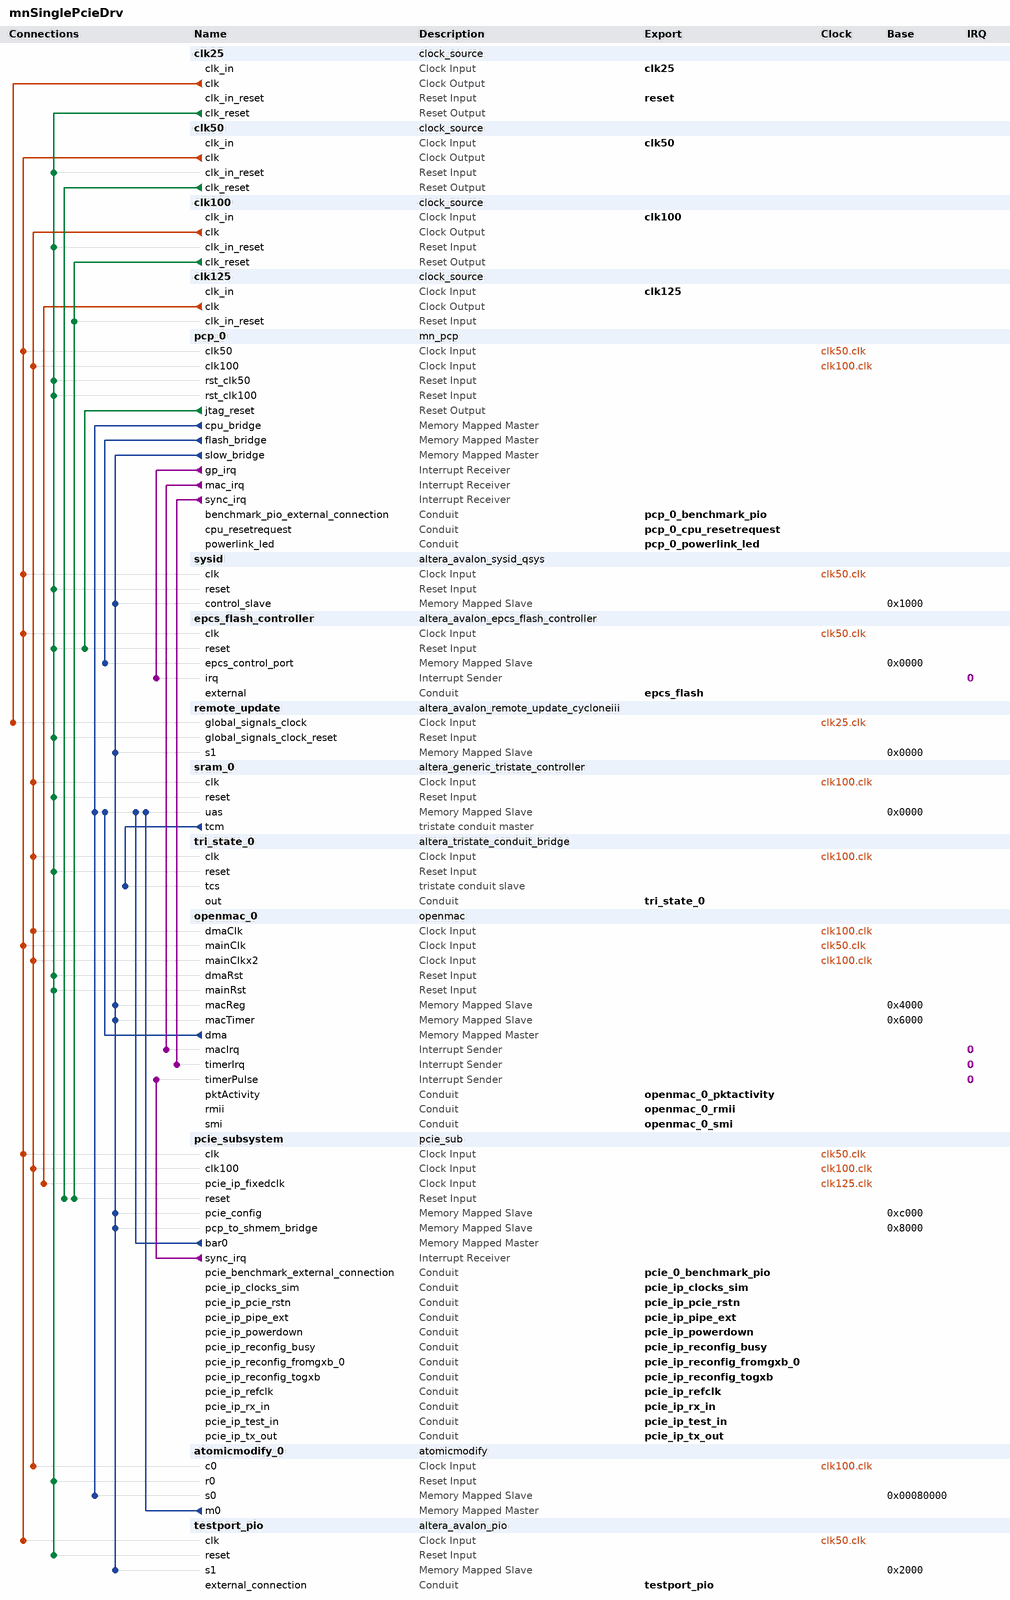
[diagram p0: system contents]
# Platform Designer (Qsys) system mnSinglePcieDrv, Cyclone IV GX EP4CGX30CF19I7
# Parameters at their usual value, and those the tool derives, are not listed.
package require -exact qsys 13.0
create_system mnSinglePcieDrv
set_project_property DEVICE_FAMILY {Cyclone IV GX}
set_project_property DEVICE EP4CGX30CF19I7

add_instance clk25 clock_source 13.0
set_instance_parameter_value clk25 clockFrequency 25000000

add_instance clk50 clock_source 13.0
set_instance_parameter_value clk50 clockFrequency 50000000

add_instance clk100 clock_source 13.0
set_instance_parameter_value clk100 clockFrequency 100000000

add_instance clk125 clock_source 13.0
set_instance_parameter_value clk125 clockFrequency 125000000

add_instance pcp_0 mn_pcp 1.0
set_instance_parameter_value pcp_0 cpu0_resetCpuBridge flash_bridge

add_instance sysid altera_avalon_sysid_qsys 13.0
set_instance_parameter_value sysid id 0

add_instance epcs_flash_controller altera_avalon_epcs_flash_controller 13.0.1.99.2

add_instance remote_update altera_avalon_remote_update_cycloneiii 13.0
set_instance_parameter_value remote_update clockFrequency 25000000

add_instance sram_0 altera_generic_tristate_controller 13.0
set_instance_parameter_value sram_0 TCM_ADDRESS_W 19
set_instance_parameter_value sram_0 TCM_DATA_W 16
set_instance_parameter_value sram_0 TCM_BYTEENABLE_W 2
set_instance_parameter_value sram_0 TCM_READ_WAIT 1
set_instance_parameter_value sram_0 TCM_WRITE_WAIT 1
set_instance_parameter_value sram_0 TCM_SETUP_WAIT 0
set_instance_parameter_value sram_0 TCM_DATA_HOLD 0
set_instance_parameter_value sram_0 TCM_MAX_PENDING_READ_TRANSACTIONS 1
set_instance_parameter_value sram_0 TCM_TURNAROUND_TIME 1
set_instance_parameter_value sram_0 TCM_TIMING_UNITS 1
set_instance_parameter_value sram_0 TCM_READLATENCY 2
set_instance_parameter_value sram_0 TCM_SYMBOLS_PER_WORD 2
set_instance_parameter_value sram_0 USE_READ 1
set_instance_parameter_value sram_0 USE_BEGINTRANSFER 0
set_instance_parameter_value sram_0 USE_BYTEENABLE 1
set_instance_parameter_value sram_0 USE_OUTPUTENABLE 0
set_instance_parameter_value sram_0 ACTIVE_LOW_READ 1
set_instance_parameter_value sram_0 ACTIVE_LOW_BYTEENABLE 1
set_instance_parameter_value sram_0 ACTIVE_LOW_OUTPUTENABLE 0
set_instance_parameter_value sram_0 ACTIVE_LOW_BEGINTRANSFER 0
set_instance_parameter_value sram_0 CHIPSELECT_THROUGH_READLATENCY 0
set_instance_parameter_value sram_0 MODULE_ASSIGNMENT_KEYS embeddedsw.CMacro.SIZE
set_instance_parameter_value sram_0 MODULE_ASSIGNMENT_VALUES 524288

add_instance tri_state_0 altera_tristate_conduit_bridge 13.0

add_instance openmac_0 openmac 1.0.2
set_instance_parameter_value openmac_0 gui_phyType 1
set_instance_parameter_value openmac_0 gui_phyCount 1
set_instance_parameter_value openmac_0 gui_extraSmi false
set_instance_parameter_value openmac_0 gui_txBufLoc 2
set_instance_parameter_value openmac_0 gui_txBufSize 1
set_instance_parameter_value openmac_0 gui_txBurstSize 8
set_instance_parameter_value openmac_0 gui_rxBurstSize 1
set_instance_parameter_value openmac_0 gui_tmrPulse true
set_instance_parameter_value openmac_0 gui_actEn true
set_instance_parameter_value openmac_0 gui_sdcEn true

add_instance pcie_subsystem pcie_sub 1.0
set_instance_parameter_value pcie_subsystem vendor_id 5751
set_instance_parameter_value pcie_subsystem device_id 59401
set_instance_parameter_value pcie_subsystem revision_id 1
set_instance_parameter_value pcie_subsystem class_code 557104
set_instance_parameter_value pcie_subsystem subsystem_vendor_id 5751
set_instance_parameter_value pcie_subsystem subsystem_id 58658

add_instance atomicmodify_0 atomicmodify 1.1.0
set_instance_parameter_value atomicmodify_0 sys_m0Addrw 19

add_instance testport_pio altera_avalon_pio 13.0.1.99.2
set_instance_parameter_value testport_pio direction Output
set_instance_parameter_value testport_pio width 8

# connections
add_connection clk25.clk remote_update.global_signals_clock clock
add_connection clk50.clk epcs_flash_controller.clk clock
add_connection clk50.clk openmac_0.mainClk clock
add_connection clk50.clk pcie_subsystem.clk clock
add_connection clk50.clk pcp_0.clk50 clock
add_connection clk50.clk sysid.clk clock
add_connection clk50.clk testport_pio.clk clock
add_connection clk100.clk atomicmodify_0.c0 clock
add_connection clk100.clk openmac_0.dmaClk clock
add_connection clk100.clk openmac_0.mainClkx2 clock
add_connection clk100.clk pcie_subsystem.clk100 clock
add_connection clk100.clk pcp_0.clk100 clock
add_connection clk100.clk sram_0.clk clock
add_connection clk100.clk tri_state_0.clk clock
add_connection clk125.clk pcie_subsystem.pcie_ip_fixedclk clock
add_connection clk25.clk_reset atomicmodify_0.r0 reset
add_connection clk25.clk_reset clk50.clk_in_reset reset
add_connection clk25.clk_reset clk100.clk_in_reset reset
add_connection clk25.clk_reset epcs_flash_controller.reset reset
add_connection clk25.clk_reset openmac_0.dmaRst reset
add_connection clk25.clk_reset openmac_0.mainRst reset
add_connection clk25.clk_reset pcp_0.rst_clk50 reset
add_connection clk25.clk_reset pcp_0.rst_clk100 reset
add_connection clk25.clk_reset remote_update.global_signals_clock_reset reset
add_connection clk25.clk_reset sram_0.reset reset
add_connection clk25.clk_reset sysid.reset reset
add_connection clk25.clk_reset testport_pio.reset reset
add_connection clk25.clk_reset tri_state_0.reset reset
add_connection clk50.clk_reset pcie_subsystem.reset reset
add_connection clk100.clk_reset clk125.clk_in_reset reset
add_connection clk100.clk_reset pcie_subsystem.reset reset
add_connection pcp_0.jtag_reset epcs_flash_controller.reset reset
add_connection atomicmodify_0.m0 sram_0.uas avalon
set_connection_parameter_value atomicmodify_0.m0/sram_0.uas baseAddress 0x0000
add_connection openmac_0.dma sram_0.uas avalon
set_connection_parameter_value openmac_0.dma/sram_0.uas baseAddress 0x0000
add_connection pcie_subsystem.bar0 sram_0.uas avalon
set_connection_parameter_value pcie_subsystem.bar0/sram_0.uas baseAddress 0x0000
add_connection pcp_0.cpu_bridge atomicmodify_0.s0 avalon
set_connection_parameter_value pcp_0.cpu_bridge/atomicmodify_0.s0 baseAddress 0x00080000
add_connection pcp_0.cpu_bridge sram_0.uas avalon
set_connection_parameter_value pcp_0.cpu_bridge/sram_0.uas baseAddress 0x0000
add_connection pcp_0.flash_bridge epcs_flash_controller.epcs_control_port avalon
set_connection_parameter_value pcp_0.flash_bridge/epcs_flash_controller.epcs_control_port baseAddress 0x0000
add_connection pcp_0.slow_bridge openmac_0.macReg avalon
set_connection_parameter_value pcp_0.slow_bridge/openmac_0.macReg baseAddress 0x4000
add_connection pcp_0.slow_bridge openmac_0.macTimer avalon
set_connection_parameter_value pcp_0.slow_bridge/openmac_0.macTimer baseAddress 0x6000
add_connection pcp_0.slow_bridge pcie_subsystem.pcie_config avalon
set_connection_parameter_value pcp_0.slow_bridge/pcie_subsystem.pcie_config baseAddress 0xc000
add_connection pcp_0.slow_bridge pcie_subsystem.pcp_to_shmem_bridge avalon
set_connection_parameter_value pcp_0.slow_bridge/pcie_subsystem.pcp_to_shmem_bridge baseAddress 0x8000
add_connection pcp_0.slow_bridge remote_update.s1 avalon
set_connection_parameter_value pcp_0.slow_bridge/remote_update.s1 baseAddress 0x0000
add_connection pcp_0.slow_bridge sysid.control_slave avalon
set_connection_parameter_value pcp_0.slow_bridge/sysid.control_slave baseAddress 0x1000
add_connection pcp_0.slow_bridge testport_pio.s1 avalon
set_connection_parameter_value pcp_0.slow_bridge/testport_pio.s1 baseAddress 0x2000
add_connection pcie_subsystem.sync_irq openmac_0.timerPulse interrupt
set_connection_parameter_value pcie_subsystem.sync_irq/openmac_0.timerPulse irqNumber 0
add_connection pcp_0.gp_irq epcs_flash_controller.irq interrupt
set_connection_parameter_value pcp_0.gp_irq/epcs_flash_controller.irq irqNumber 0
add_connection pcp_0.mac_irq openmac_0.macIrq interrupt
set_connection_parameter_value pcp_0.mac_irq/openmac_0.macIrq irqNumber 0
add_connection pcp_0.sync_irq openmac_0.timerIrq interrupt
set_connection_parameter_value pcp_0.sync_irq/openmac_0.timerIrq irqNumber 0
add_connection sram_0.tcm tri_state_0.tcs tristate_conduit

# exported interfaces
add_interface clk50 clock sink
set_interface_property clk50 EXPORT_OF clk50.clk_in
add_interface clk100 clock sink
set_interface_property clk100 EXPORT_OF clk100.clk_in
add_interface clk25 clock sink
set_interface_property clk25 EXPORT_OF clk25.clk_in
add_interface reset reset sink
set_interface_property reset EXPORT_OF clk25.clk_in_reset
add_interface pcp_0_benchmark_pio conduit end
set_interface_property pcp_0_benchmark_pio EXPORT_OF pcp_0.benchmark_pio_external_connection
add_interface epcs_flash conduit end
set_interface_property epcs_flash EXPORT_OF epcs_flash_controller.external
add_interface tri_state_0 conduit end
set_interface_property tri_state_0 EXPORT_OF tri_state_0.out
add_interface openmac_0_smi conduit end
set_interface_property openmac_0_smi EXPORT_OF openmac_0.smi
add_interface openmac_0_rmii conduit end
set_interface_property openmac_0_rmii EXPORT_OF openmac_0.rmii
add_interface pcie_ip_rx_in conduit end
set_interface_property pcie_ip_rx_in EXPORT_OF pcie_subsystem.pcie_ip_rx_in
add_interface pcie_ip_tx_out conduit end
set_interface_property pcie_ip_tx_out EXPORT_OF pcie_subsystem.pcie_ip_tx_out
add_interface pcie_ip_reconfig_togxb conduit end
set_interface_property pcie_ip_reconfig_togxb EXPORT_OF pcie_subsystem.pcie_ip_reconfig_togxb
add_interface pcie_ip_reconfig_fromgxb_0 conduit end
set_interface_property pcie_ip_reconfig_fromgxb_0 EXPORT_OF pcie_subsystem.pcie_ip_reconfig_fromgxb_0
add_interface clk125 clock sink
set_interface_property clk125 EXPORT_OF clk125.clk_in
add_interface pcie_ip_refclk conduit end
set_interface_property pcie_ip_refclk EXPORT_OF pcie_subsystem.pcie_ip_refclk
add_interface pcie_ip_test_in conduit end
set_interface_property pcie_ip_test_in EXPORT_OF pcie_subsystem.pcie_ip_test_in
add_interface pcie_ip_pcie_rstn conduit end
set_interface_property pcie_ip_pcie_rstn EXPORT_OF pcie_subsystem.pcie_ip_pcie_rstn
add_interface pcie_ip_clocks_sim conduit end
set_interface_property pcie_ip_clocks_sim EXPORT_OF pcie_subsystem.pcie_ip_clocks_sim
add_interface pcie_ip_reconfig_busy conduit end
set_interface_property pcie_ip_reconfig_busy EXPORT_OF pcie_subsystem.pcie_ip_reconfig_busy
add_interface pcie_ip_pipe_ext conduit end
set_interface_property pcie_ip_pipe_ext EXPORT_OF pcie_subsystem.pcie_ip_pipe_ext
add_interface pcie_ip_powerdown conduit end
set_interface_property pcie_ip_powerdown EXPORT_OF pcie_subsystem.pcie_ip_powerdown
add_interface pcie_0_benchmark_pio conduit end
set_interface_property pcie_0_benchmark_pio EXPORT_OF pcie_subsystem.pcie_benchmark_external_connection
add_interface pcp_0_cpu_resetrequest conduit end
set_interface_property pcp_0_cpu_resetrequest EXPORT_OF pcp_0.cpu_resetrequest
add_interface openmac_0_pktactivity conduit end
set_interface_property openmac_0_pktactivity EXPORT_OF openmac_0.pktActivity
add_interface testport_pio conduit end
set_interface_property testport_pio EXPORT_OF testport_pio.external_connection
add_interface pcp_0_powerlink_led conduit end
set_interface_property pcp_0_powerlink_led EXPORT_OF pcp_0.powerlink_led

set_interconnect_requirement {$system} qsys_mm.clockCrossingAdapter HANDSHAKE
set_interconnect_requirement {$system} qsys_mm.maxAdditionalLatency 1

save_system mnSinglePcieDrv.qsys
